# EAGLE design ir_board_mount (EAGLE 6.5.0)
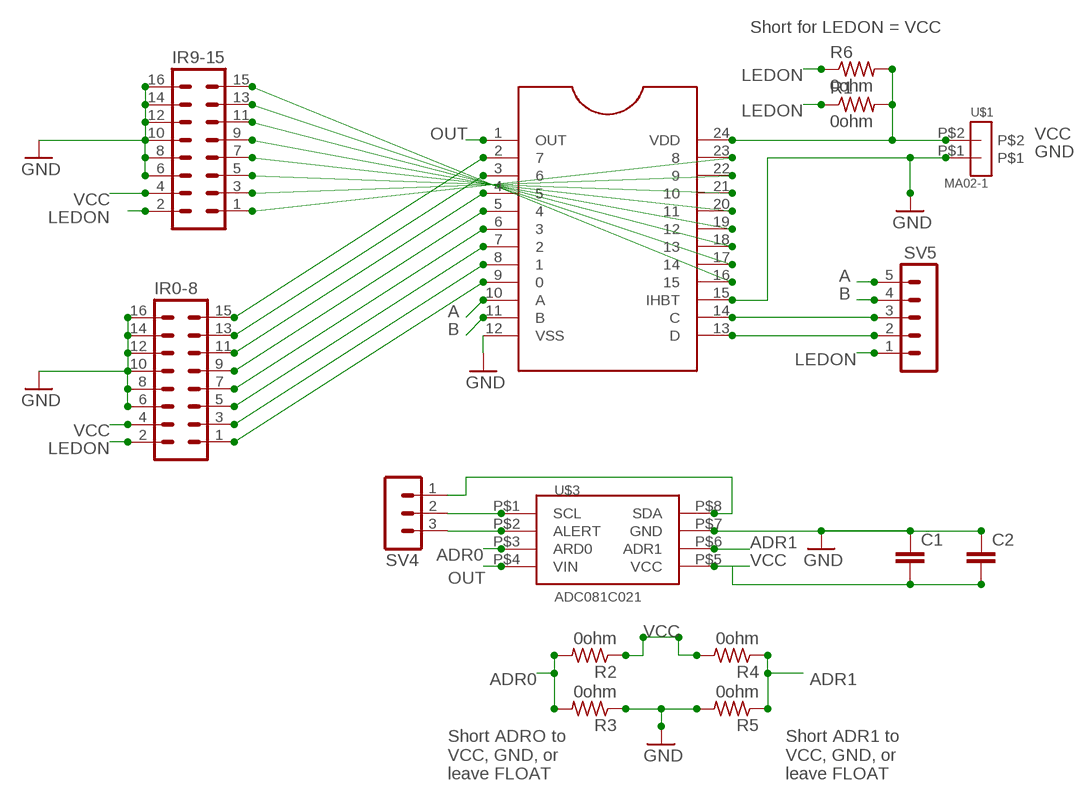
[diagram p0: schematic, sheet 1]

## Parts
C1  C-EUC0805K  [C0805K]
C2  C-EUC0805K  [C0805K]
IR0-8  MA08-2  [MA08-2]
IR9-15  MA08-2  [MA08-2]
R1  0ohm  R-US_R0805  [R0805]
R2  0ohm  R-US_R0805  [R0805]
R3  0ohm  R-US_R0805  [R0805]
R4  0ohm  R-US_R0805  [R0805]
R5  0ohm  R-US_R0805  [R0805]
R6  0ohm  R-US_R0805  [R0805]
SV4  MA03-1  [MA03-1]
SV5  MA05-1  [MA05-1]
U$1  MA02-1  [MA02-1]
U$2  16BIT_ANALOG_MUX  [DIL24-6]
U$3  ADC081C021  [TSSOP-8]

## Nets
A: SV5.5 U$2.10(A)
ADR0: R2.2 R3.2 U$3.P$3(ARD0)
ADR1: R4.1 R5.1 U$3.P$6(ADR1)
ALERT: SV4.3 U$3.P$2(ALERT)
B: SV5.4 U$2.11(B)
GND [power]: C1.1 C2.1 IR0-8.6 IR0-8.8 IR0-8.10 IR0-8.12 IR0-8.14 IR0-8.16 IR9-15.6 IR9-15.8 IR9-15.10 IR9-15.12 IR9-15.14 IR9-15.16 R3.1 R5.2 U$1.P$1 U$2.12(VSS) U$2.15(IHBT) U$3.P$7(GND)
LEDON: IR0-8.2 IR9-15.2 R1.1 R6.1 SV5.1
N$1: IR0-8.1 U$2.9
N$2: IR0-8.3 U$2.8
N$3: IR0-8.5 U$2.7
N$4: IR0-8.7 U$2.6
N$5: IR0-8.9 U$2.5
N$6: IR0-8.11 U$2.4
N$7: IR0-8.13 U$2.3
N$8: IR0-8.15 U$2.2
N$9: IR9-15.1 U$2.23
N$10: IR9-15.3 U$2.22
N$11: IR9-15.5 U$2.21
N$12: IR9-15.7 U$2.20
N$13: IR9-15.9 U$2.19
N$14: IR9-15.11 U$2.18
N$15: IR9-15.13 U$2.17
N$16: IR9-15.15 U$2.16
N$17: SV5.2 U$2.13(D)
N$18: SV5.3 U$2.14(C)
OUT: U$2.1(OUT) U$3.P$4(VIN)
SCL: SV4.2 U$3.P$1(SCL)
SDA: SV4.1 U$3.P$8(SDA)
VCC [power]: C1.2 C2.2 IR0-8.4 IR9-15.4 R1.2 R2.1 R4.2 R6.2 U$1.P$2 U$2.24(VDD) U$3.P$5(VCC)

## Notes on the sheet
- Short for LEDON = VCC
- Short ADRO to
  VCC, GND, or
  leave FLOAT
- Short ADR1 to
  VCC, GND, or
  leave FLOAT

## Library data of the parts
C1 C2 = rcl:C-EU: CAPACITOR, European symbol
IR0-8 IR9-15 = con-lstb:MA08-2: PIN HEADER; OC_FARNELL: unknown; OC_NEWARK: unknown
R1-R6 = rcl:R-US_: RESISTOR, American symbol
SV4 = con-lstb:MA03-1: PIN HEADER; OC_FARNELL: unknown; OC_NEWARK: unknown
SV5 = con-lstb:MA05-1: PIN HEADER; OC_FARNELL: unknown; OC_NEWARK: unknown
U$1 = IEEE_bot_specific_parts:MA02-1
U$2 = IEEE_bot_specific_parts:16BIT_ANALOG_MUX: CD4067B 16Bit Analog Mux http://www.ti.com/lit/ds/symlink/cd4067b.pdf
U$3 = IEEE_bot_specific_parts:ADC081C021

## Net classes
0 default: width 0.203 mm, drill 0.152 mm, clearance 0.254 mm
1 power: width 0.254 mm, drill 0.203 mm, clearance 0.305 mm

## Board
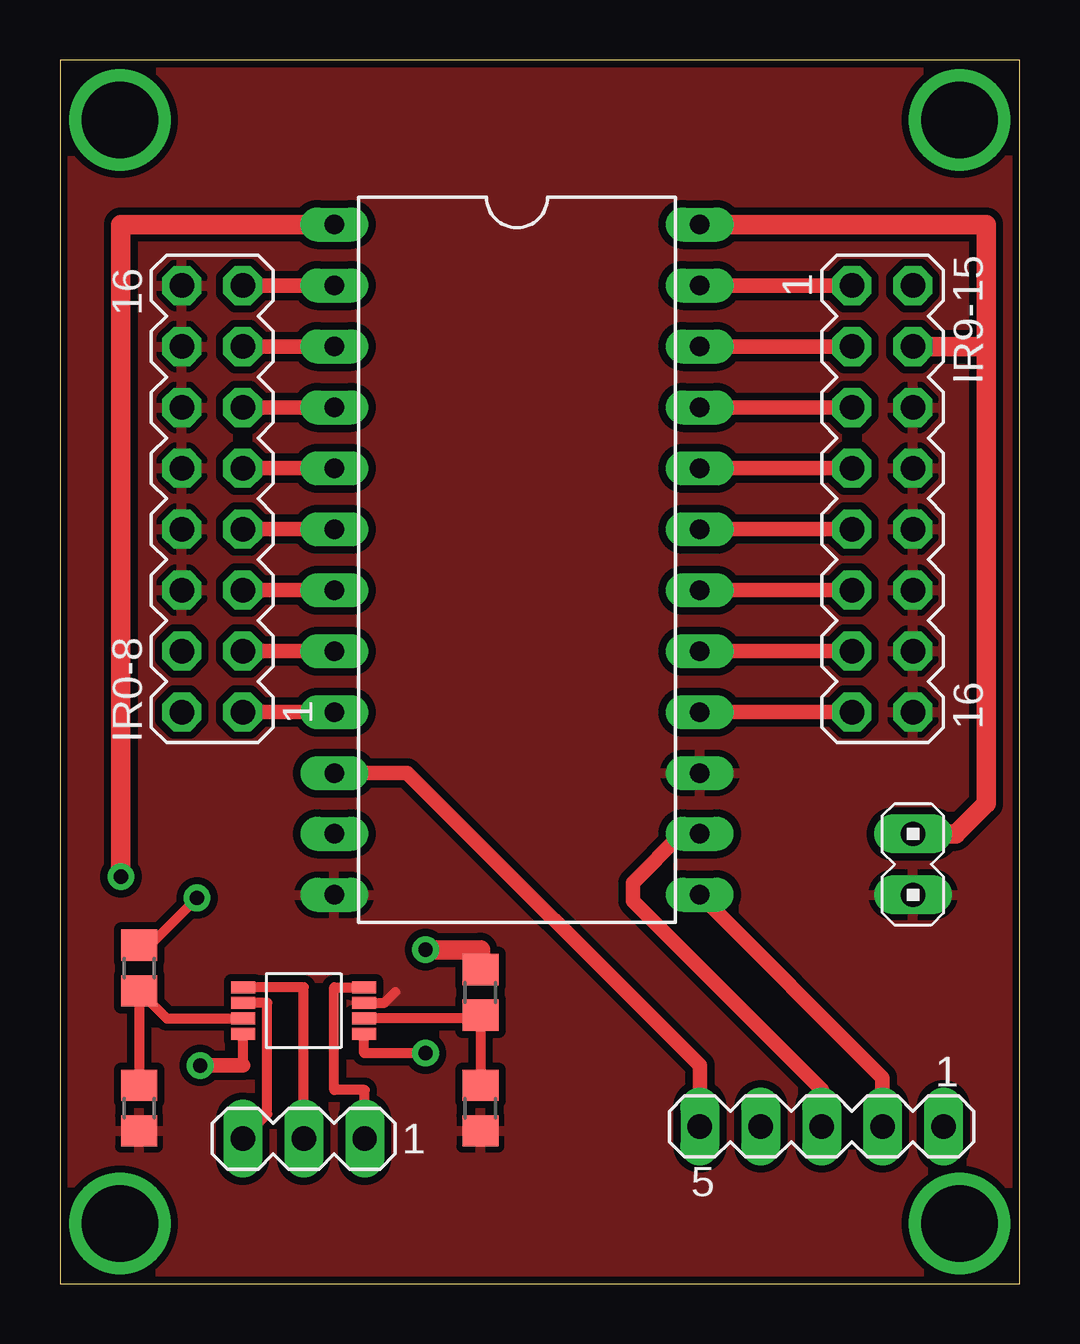
[diagram p1: board, top side]
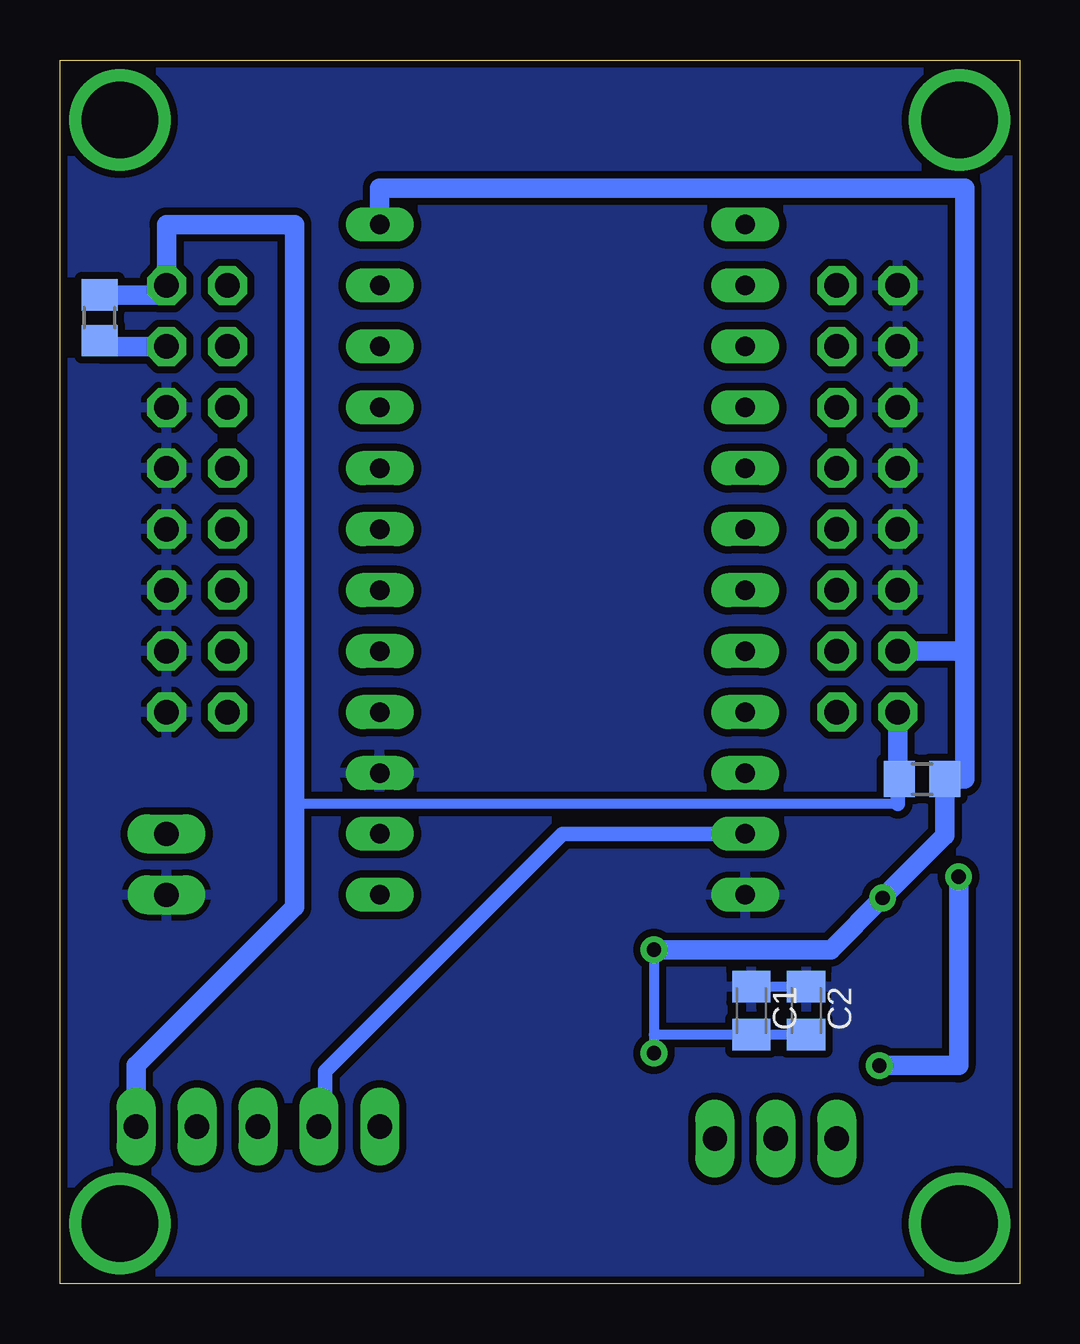
[diagram p2: board, bottom side, seen from below]

Size 40 x 51 mm. Coordinates in mm from the lower left corner, seen from the top.
Outline: 0,0 40,0 40,51 0,51 0,0
Copper layers (1*16): Top 0.035mm / dielectric 1.5mm / Bottom 0.035mm
Design rules "SparkFun": minimum track width 8mil, minimum drill 20mil, track to track 8mil, track to pad 8mil, pad to pad 8mil, via to via 8mil, smd to smd 8mil, copper to edge 10mil, drill to drill 8mil, minimum pad ring 12mil, minimum via ring 10mil, stop-mask expansion 4mil, vias tented up to drill 25mil, thermal gap 10mil

### Footprints (pad centres in the part's own frame; a part is rotated, then mirrored left to right if it is on the bottom)
C0805K = smd 1.3 x 1.6: 1 -1,0; 2 1,0
MA08-2 = drill 1.016 octagon: 1 -8.89,-1.27; 2 -8.89,1.27; 3 -6.35,-1.27; 4 -6.35,1.27; 5 -3.81,-1.27; 6 -3.81,1.27; 7 -1.27,-1.27; 8 -1.27,1.27; 9 1.27,-1.27; 10 1.27,1.27; 11 3.81,-1.27; 12 3.81,1.27; 13 6.35,-1.27; 14 6.35,1.27; 15 8.89,-1.27; 16 8.89,1.27
R0805 = smd 1.3 x 1.5: 1 -0.95,0; 2 0.95,0
MA03-1 = drill 1.016 long: 1 -2.54,0; 2 0,0; 3 2.54,0
MA05-1 = drill 1.016 long: 1 -5.08,0; 2 -2.54,0; 3 0,0; 4 2.54,0; 5 5.08,0
MA02-1 = drill 1.016 long: P$1 -1.27,0; P$2 1.27,0
DIL24-6 = drill 0.813 long: 1 -13.97,-7.62; 2 -11.43,-7.62; 3 -8.89,-7.62; 4 -6.35,-7.62; 5 -3.81,-7.62; 6 -1.27,-7.62; 7 1.27,-7.62; 8 3.81,-7.62; 9 6.35,-7.62; 10 8.89,-7.62; 11 11.43,-7.62; 12 13.97,-7.62; 13 13.97,7.62; 14 11.43,7.62; 15 8.89,7.62; 16 6.35,7.62; 17 3.81,7.62; 18 1.27,7.62; 19 -1.27,7.62; 20 -3.81,7.62; 21 -6.35,7.62; 22 -8.89,7.62; 23 -11.43,7.62; 24 -13.97,7.62
TSSOP-8 = smd 0.5 x 1: P$1 -0.975,-2.525; P$2 -0.325,-2.525; P$3 0.325,-2.525; P$4 0.975,-2.525; P$5 0.975,2.525; P$6 0.325,2.525; P$7 -0.325,2.525; P$8 -0.975,2.525

### Placement (x,y rotation side)
C1  11.18,11.37 270 bottom
C2  8.89,11.37 270 bottom
IR0-8  6.35,32.71 90 top
IR9-15  34.29,32.71 270 top
R1  38.35,40.26 270 bottom
R2  3.3,13.15 270 top
R3  3.3,7.31 90 top
R4  17.53,12.14 90 top
R5  17.53,7.31 270 top
R6  4.06,21.03 0 bottom
SV4  10.16,6.04 180 top
SV5  31.75,6.55 180 top
U$1  35.56,17.47 90 top
U$2  19.05,30.17 270 top
U$3  10.16,11.37 270 top

### Tracks (layer width: path | path; a pad name or v marks a point on that pad's centre or on a via)
A
  Top 0.61: SV5.5 26.67,9.09 14.48,21.28 U$2.10
ADR0
  Top 0.406: R3.2 R2.2 4.46,11.05 U$3.P$3
ADR1
  Top 0.406: U$3.P$6 17.53,11.05 R4.1 R5.1
ALERT
  Top 0.406: SV4.3 8.64,7.06 8.64,11.7 U$3.P$2
B
  Bottom 0.61: SV5.4 28.96,6.8 28.96,8.83 19.05,18.74 U$2.11
GND
  Top 0.406: U$3.P$7 13.53,11.7 13.97,12.14
  Top 0.813: U$1.P$1 35.31,16.45
  Bottom 0.406: C2.1 C1.1
  pour Top (isolate 0.305): 0,50.49 41.15,50.74 40.64,0 -0.51,0
  pour Bottom (isolate 0.305): -0.25,51 41.15,51.25 41.15,0 -0.25,0
LEDON
  Bottom 0.406: 5.08,19.98 30.23,19.98
  Bottom 0.61: 5.08,21.03 5.08,19.98
  Bottom 0.813: R1.1 35.56,41.21 IR9-15.2 35.56,44.14 30.23,44.14 30.23,19.98 30.23,15.69 36.83,9.09 SV5.1 | R6.1 5.08,21.03 IR0-8.2
N$1
  Top 0.61: IR0-8.1 U$2.9
N$2
  Top 0.61: IR0-8.3 U$2.8
N$3
  Top 0.61: IR0-8.5 U$2.7
N$4
  Top 0.61: IR0-8.7 U$2.6
N$5
  Top 0.61: IR0-8.9 U$2.5
N$6
  Top 0.61: IR0-8.11 U$2.4
N$7
  Top 0.61: IR0-8.13 U$2.3
N$8
  Top 0.61: IR0-8.15 U$2.2
N$9
  Top 0.61: IR9-15.1 U$2.23
N$10
  Top 0.61: IR9-15.3 U$2.22
N$11
  Top 0.61: U$2.21 IR9-15.5
N$12
  Top 0.61: IR9-15.7 U$2.20
N$13
  Top 0.61: U$2.19 IR9-15.9
N$14
  Top 0.61: IR9-15.11 U$2.18
N$15
  Top 0.61: U$2.17 IR9-15.13
N$16
  Top 0.61: U$2.16 IR9-15.15
N$17
  Top 0.61: SV5.2 34.29,8.58 U$2.13
N$18
  Top 0.61: SV5.3 31.75,8.07 23.88,15.95 23.88,16.71 25.91,18.74 U$2.14
N$19  (via drill 3.2)
  other vias: 2.5,2.5
N$20  (via drill 3.2)
  other vias: 2.5,48.5
N$21  (via drill 3.2)
  other vias: 37.5,2.5
N$22  (via drill 3.2)
  other vias: 37.5,48.5
OUT  (via drill 0.6)
  Top 0.406: 7.63,9.09 U$3.P$4
  Top 0.61: v5.84,9.09 7.63,9.09
  Top 0.813: U$2.1 2.54,44.14 v2.54,16.96
  Bottom 0.813: v2.54,16.96 2.54,9.09 v5.84,9.09
SCL
  Top 0.406: SV4.2 10.16,12.35 U$3.P$1
SDA
  Top 0.406: SV4.1 12.7,8.07 11.43,8.07 11.43,12.35 U$3.P$8
VCC  (via drill 0.6)
  Top 0.406: v15.24,9.6 12.69,9.6 U$3.P$5 | 15.24,13.85 v15.24,13.91 | R2.1 3.74,14.1 v5.71,16.07
  Top 0.813: U$1.P$2 37.34,18.74 38.61,20.01 38.61,39.06 | IR9-15.4 38.61,39.06 | 38.61,39.06 38.61,44.14 U$2.24 | v15.24,13.91 17.53,13.91 R4.2
  Bottom 0.406: v15.24,13.91 v15.24,9.6 15.24,10.37 C1.2 C2.2
  Bottom 0.813: U$2.24 26.67,45.66 2.29,45.66 2.29,26.36 | 2.29,26.36 2.29,21.03 R6.2 3.11,18.67 v5.71,16.07 7.87,13.91 v15.24,13.91 | 2.29,26.36 IR0-8.4 | R1.2 38.35,39.06 IR9-15.4

### Text on the board
tDocu: VCC | GND | VCC | VCC | ADR0 | ADR1 | LEDON | SEL_A | SEL_B | SEL_C | SEL_D | SCA | SDA | GND | GND | ALRT
bDocu: Short for / LEDON=VCC | 16 Bit IR ARRAY / 2x Pololu QTR-8A / v. 2013/11/27 | Short for / LEDON=VCC | Debounce Caps